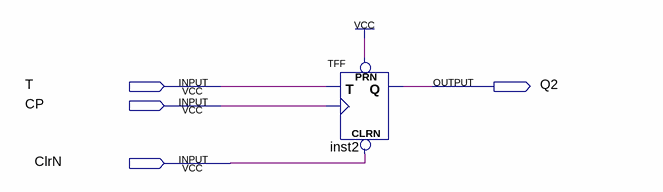
[diagram p0: schematic sheet]
// Quartus schematic jkff_test.bdf as structural Verilog: 1 symbols, 4 pins
module jkff_test (
  input  T,
  input  CP,
  input  ClrN,
  output Q2
);

  TFF inst2 (.PRN(1'b1), .CLRN(ClrN), .T(T), .CLK(CP), .Q(Q2));
endmodule
